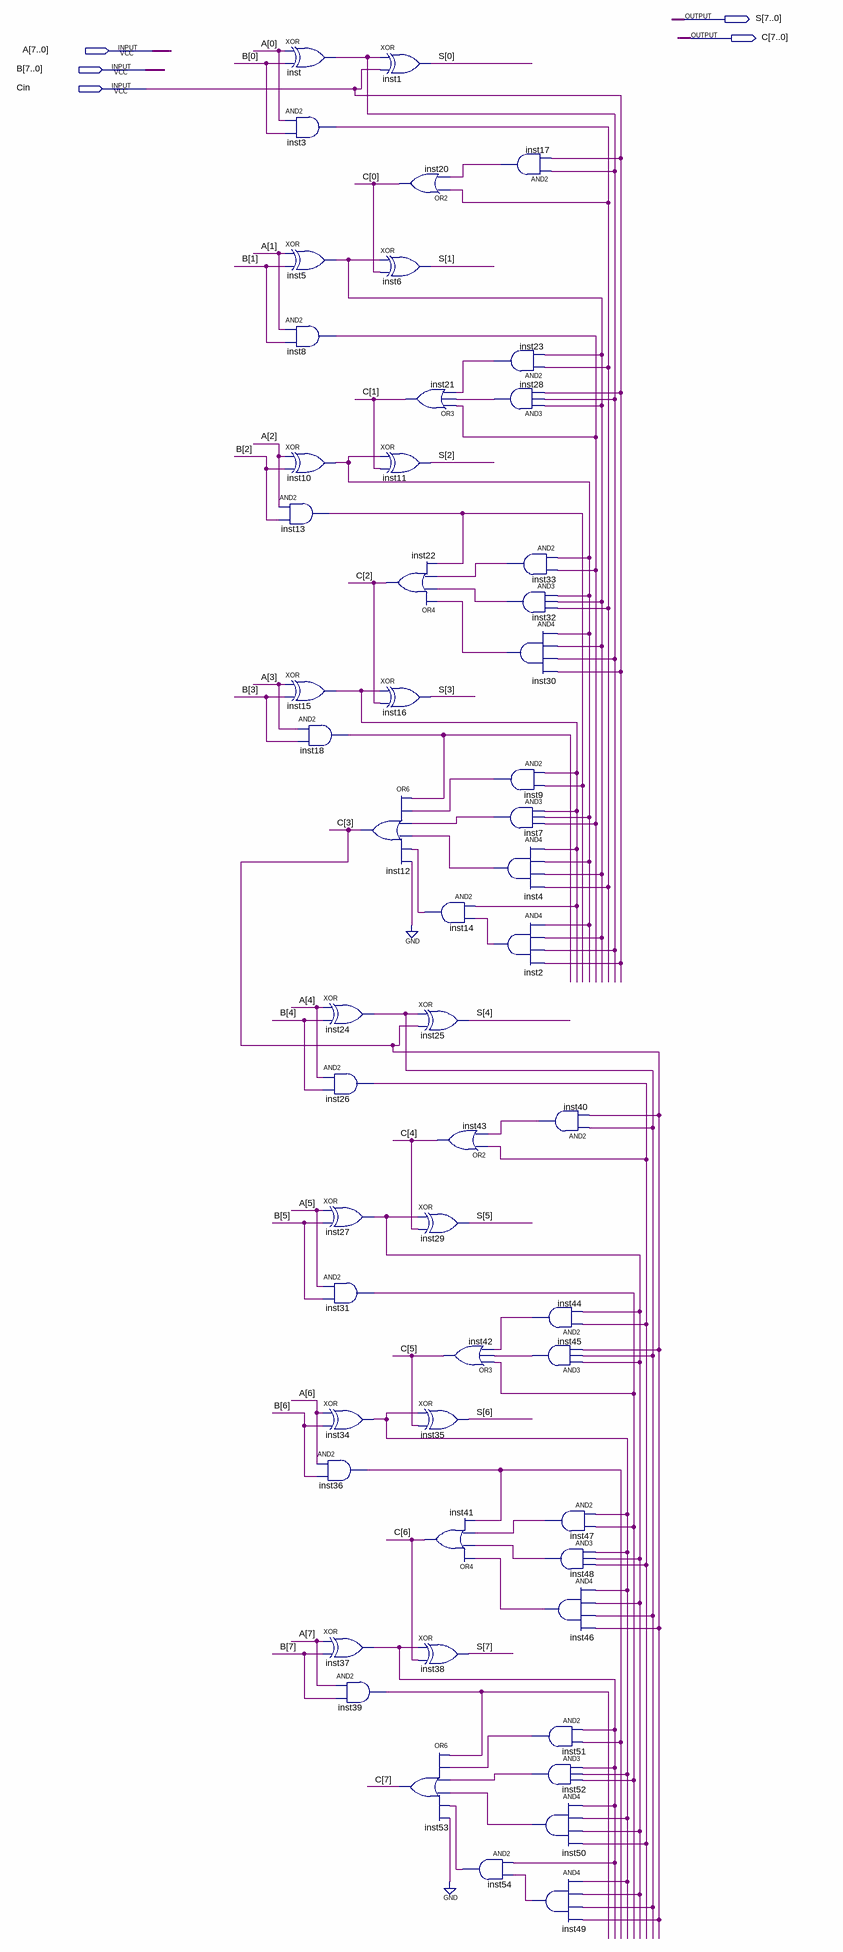
[diagram p0: schematic sheet]
// Quartus schematic CLAAdder.bdf as structural Verilog: 54 symbols, 5 pins
module CLAAdder (
  input  [7:0] A,
  input  [7:0] B,
  input  Cin,
  output [7:0] S,
  output [7:0] C
);

  wire inst2_out, inst3_out, inst4_out, inst5_out, inst7_out, inst8_out, inst9_out, inst10_out, inst13_out,
       inst14_out, inst15_out, inst17_out, inst18_out, inst23_out, inst24_out, inst26_out, inst27_out,
       inst28_out, inst30_out, inst31_out, inst32_out, inst33_out, inst34_out, inst36_out, inst37_out,
       inst39_out, inst40_out, inst44_out, inst45_out, inst46_out, inst47_out, inst48_out, inst49_out,
       inst50_out, inst51_out, inst52_out, inst54_out, inst_out;

  xor inst (inst_out, A[0], B[0]);
  and inst3 (inst3_out, A[0], B[0]);
  xor inst5 (inst5_out, A[1], B[1]);
  and inst8 (inst8_out, A[1], B[1]);
  xor inst10 (inst10_out, A[2], B[2]);
  and inst13 (inst13_out, A[2], B[2]);
  xor inst15 (inst15_out, A[3], B[3]);
  and inst18 (inst18_out, A[3], B[3]);
  xor inst24 (inst24_out, A[4], B[4]);
  and inst26 (inst26_out, A[4], B[4]);
  xor inst27 (inst27_out, A[5], B[5]);
  and inst31 (inst31_out, A[5], B[5]);
  xor inst34 (inst34_out, A[6], B[6]);
  and inst36 (inst36_out, A[6], B[6]);
  xor inst37 (inst37_out, A[7], B[7]);
  and inst39 (inst39_out, A[7], B[7]);
  xor inst1 (S[0], inst_out, Cin);
  or inst20 (C[0], inst3_out, inst17_out);
  xor inst6 (S[1], inst5_out, C[0]);
  xor inst11 (S[2], inst10_out, C[1]);
  or inst22 (C[2], inst30_out, inst32_out, inst33_out, inst13_out);
  xor inst16 (S[3], inst15_out, C[2]);
  or inst12 (C[3], inst18_out, inst9_out, inst7_out, inst4_out, inst14_out, 1'b0);
  or inst53 (C[7], inst39_out, inst51_out, inst52_out, inst50_out, inst54_out, 1'b0);
  or inst21 (C[1], inst8_out, inst28_out, inst23_out);
  and inst14 (inst14_out, inst15_out, inst2_out);
  xor inst25 (S[4], inst24_out, C[3]);
  or inst43 (C[4], inst26_out, inst40_out);
  xor inst29 (S[5], inst27_out, C[4]);
  or inst42 (C[5], inst31_out, inst45_out, inst44_out);
  xor inst35 (S[6], inst34_out, C[5]);
  or inst41 (C[6], inst46_out, inst48_out, inst47_out, inst36_out);
  xor inst38 (S[7], inst37_out, C[6]);
  and inst17 (inst17_out, inst_out, Cin);
  and inst23 (inst23_out, inst3_out, inst5_out);
  and inst28 (inst28_out, inst5_out, inst_out, Cin);
  and inst9 (inst9_out, inst15_out, inst13_out);
  and inst7 (inst7_out, inst15_out, inst10_out, inst8_out);
  and inst4 (inst4_out, inst15_out, inst10_out, inst5_out, inst3_out);
  and inst2 (inst2_out, inst10_out, inst5_out, inst_out, Cin);
  and inst54 (inst54_out, inst37_out, inst49_out);
  and inst33 (inst33_out, inst10_out, inst8_out);
  and inst32 (inst32_out, inst10_out, inst5_out, inst3_out);
  and inst30 (inst30_out, inst10_out, inst5_out, inst_out, Cin);
  and inst40 (inst40_out, inst24_out, C[3]);
  and inst44 (inst44_out, inst26_out, inst27_out);
  and inst45 (inst45_out, inst27_out, inst24_out, C[3]);
  and inst47 (inst47_out, inst34_out, inst31_out);
  and inst48 (inst48_out, inst34_out, inst27_out, inst26_out);
  and inst46 (inst46_out, inst34_out, inst27_out, inst24_out, C[3]);
  and inst51 (inst51_out, inst37_out, inst36_out);
  and inst52 (inst52_out, inst37_out, inst34_out, inst31_out);
  and inst50 (inst50_out, inst37_out, inst34_out, inst27_out, inst26_out);
  and inst49 (inst49_out, inst34_out, inst27_out, inst24_out, C[3]);
endmodule
